# EasyEDA Pro project ProProject_PressureSensor_2023-10-08.epro, board PCB1_1
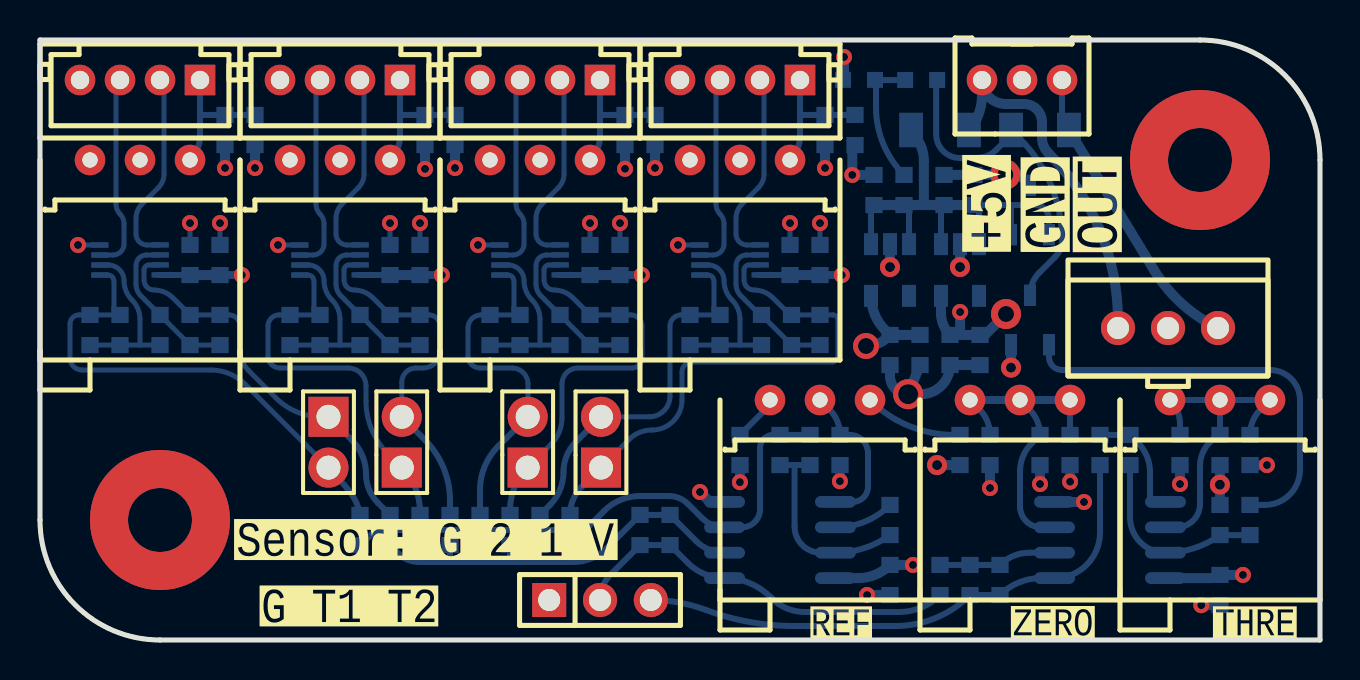
[diagram p3: board, top side]
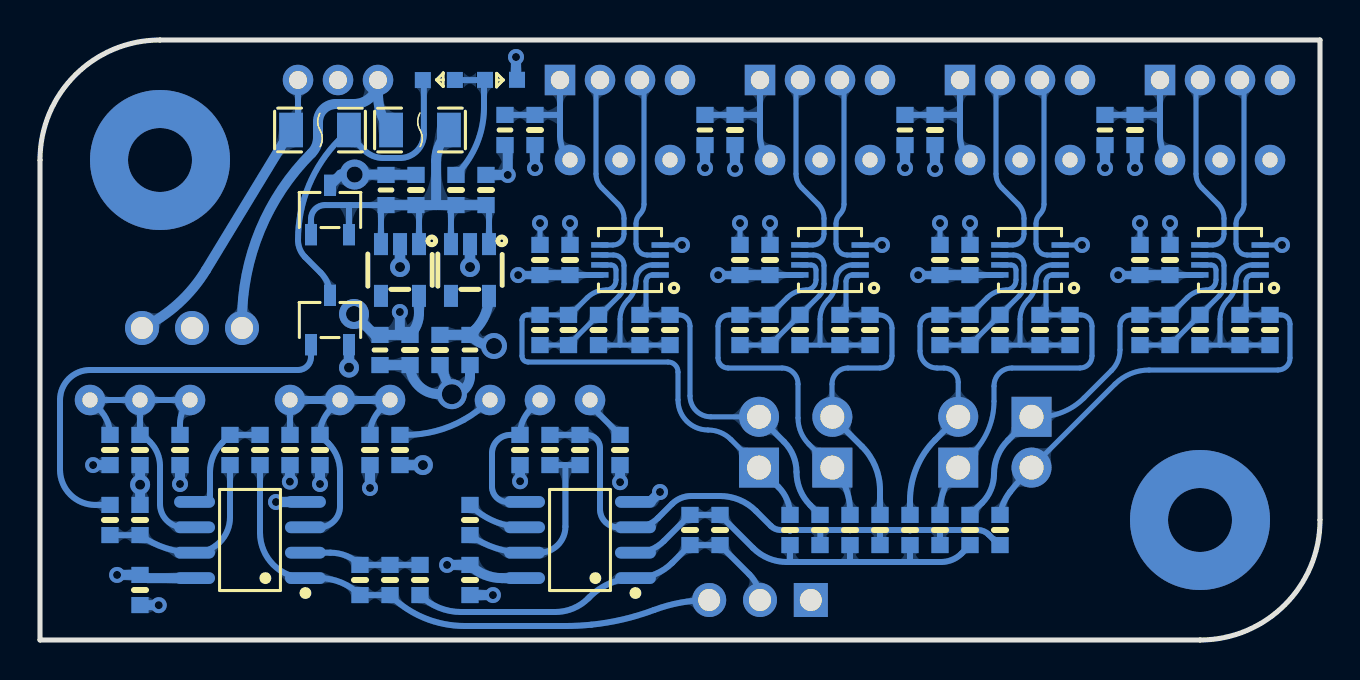
[diagram p4: board, bottom side, seen from below]

Outline 64 x 30 mm; copper layers: Top Layer, Inner1, Inner2, Bottom Layer. Coordinates in mm from the lower left corner of the outline.
Outline path: 0,6 0,30 58,30 arc(62.24,28.24) 64,24 64,0 6,0 arc(1.76,1.76) 0,6
Stack: Top Layer 0.035mm / Dielectric1 0.48mm PP er 4.5 / Inner1 0.035mm / Dielectric2 0.48mm FR4 er 4.5 / Inner2 0.035mm / Dielectric3 0.48mm PP er 4.5 / Bottom Layer 0.035mm

## Design rules (mm)
template: 自定义配置
spacing copperThickness1oz (default): track to track 0.102, other pairs 0.152 to 0.3
spacing copperThickness2oz: track to track 0.203, other pairs 0.152 to 0.3
track width copperThickness1oz (default): min 0.127, default 0.254, max 2.54
track width copperThickness2oz: min 0.203, default 0.254, max 2.54
differential pair differentialPair (default): width min 0.127, default 0.254, max 2.54; gap min 0.152, default 0.152
via viaSize (default): diameter min 0.5, default 0.61, max 10; hole min 0.3, default 0.305, max 6.3
net GND uses innerPlaneGND

## Placement (name value [footprint] x y rotation side)
C1  22uF  [R0603]  46.7 22.5 270 bottom
C2  10nF COG  [R0603]  45.2 22.5 90 bottom
C3  1uF  [R0603]  41.7 22.5 90 bottom
C4  22uF  [R0603]  42.5 14.5 90 bottom
C5  10nF COG  [R0603]  44 14.5 270 bottom
C7  22uF  [R0603]  47 14.5 90 bottom
C8  10nF COG  [R0603]  45.5 14.5 270 bottom
C9  22uF  [R0603]  10.75 25.5 90 bottom
C10  100p  [R0603]  31.5 5.5 90 bottom
C11  10nF COG  [R0603]  2.5 15.5 90 bottom
C12  100p  [R0603]  38.5 9.5 90 bottom
C13  10nF COG  [R0603]  9 15.5 270 bottom
C14  100p  [R0603]  46.5 3 90 bottom
C15  100p  [R0603]  59 6 90 bottom
C16  1uF  [R0603]  40 9.5 90 bottom
C17  1uF  [R0603]  50 9.5 90 bottom
C18  1uF  [R0603]  59 9.5 90 bottom
C19  22uF  [R0603]  20.75 25.5 90 bottom
C20  10nF COG  [R0603]  12.5 15.5 90 bottom
C21  10nF COG  [R0603]  19 15.5 270 bottom
C22  10nF COG  [R0603]  7.5 19 270 bottom
C23  10nF COG  [R0603]  17.5 19 270 bottom
C24  10nF COG  [R0603]  27.5 19 270 bottom
C25  10nF COG  [R0603]  37.5 19 270 bottom
C26  100nF  [R0603]  42.5 3 90 bottom
C27  100nF  [R0603]  59 2.5 90 bottom
C28  22uF  [R0603]  30.75 25.5 90 bottom
C29  10nF COG  [R0603]  22.5 15.5 90 bottom
C30  22uF  [R0603]  40.75 25.5 90 bottom
C31  10nF COG  [R0603]  32.5 15.5 90 bottom
C32  10nF COG  [R0603]  29 15.5 270 bottom
C33  10nF COG  [R0603]  39 15.5 270 bottom
C34  1uF  [R0603]  39 19 270 bottom
C35  1uF  [R0603]  29 19 270 bottom
C36  1uF  [R0603]  19 19 270 bottom
C37  1uF  [R0603]  9 19 270 bottom
CN1  HDGC2001WV-4P  [CONN-TH_4P-P2.00_HDGC_HDGC2001WV-4P]  5 28 180 top
CN2  HDGC2001WV-4P  [CONN-TH_4P-P2.00_HDGC_HDGC2001WV-4P]  15 28 180 top
CN3  HDGC2001WV-4P  [CONN-TH_4P-P2.00_HDGC_HDGC2001WV-4P]  25 28 180 top
CN4  HDGC2001WV-4P  [CONN-TH_4P-P2.00_HDGC_HDGC2001WV-4P]  35 28 180 top
CN5  HC-XHB-3A  [CONN-TH_3P-P2.50_HC-XHB-3A]  56.4 15.6 0 top
F1  nSMD020-30V  [F1206]  45 25.5 180 bottom
F2  nSMD020-30V  [F1206]  50 25.5 180 bottom
H2  PZ254V-11-03P  [HDR-TH_3P-P2.54-V-M]  28 2 0 top
H5  PZ254V-11-02P  [HDR-TH_2P-P2.54-V-M]  14.42 9.89 270 top
H6  PZ254V-11-02P  [HDR-TH_2P-P2.54-V-M]  24.38 9.89 90 top
H7  PZ254V-11-02P  [HDR-TH_2P-P2.54-V-M]  28.05 9.89 90 top
H8  PZ254V-11-02P  [HDR-TH_2P-P2.54-V-M]  18.09 9.89 90 top
LED3  -  [LED_0603]  41 28 0 bottom
LED4  -  [LED_0603]  44.01 28.01 180 bottom
P1  PH-3A  [CONN-TH_12P-P2.00-H-W4.8_PH-3A]  49.1 28 270 top
Q1  S8050  [SOT-23-3_L2.9-W1.6-P1.90-LS2.8-BR]  49.5 16 270 bottom
R2  2K  [R0603]  16 5.5 90 bottom
R3  15K  [R0603]  30 5.5 90 bottom
R4  2K  [R0603]  19 5.5 90 bottom
R5  50  [RES-ADJ-TH_3P-L10.0-W10.0-P2.50-L]  5 24 0 top
R6  50  [R0603]  9.25 25.5 270 bottom
R7  2K  [R0603]  22 5.5 90 bottom
R8  2K  [R0603]  4 15.5 90 bottom
R9  2K  [R0603]  25 5.5 90 bottom
R10  2K  [R0603]  17.5 5.5 90 bottom
R11  120  [R0603]  6 15.5 270 bottom
R12  2K  [R0603]  20.5 5.5 90 bottom
R13  2K  [R0603]  23.5 5.5 90 bottom
R14  2K  [R0603]  45 3 90 bottom
R15  2K  [R0603]  7.5 15.5 270 bottom
R16  2K  [R0603]  26.5 5.5 90 bottom
R17  15K  [R0603]  37 9.5 90 bottom
R18  15K  [R0603]  48 3 90 bottom
R19  2.2K  [R0603]  53 9.5 90 bottom
R20  100K  [R0603]  54.5 9.5 90 bottom
R21  2.2K  [R0603]  46 9.5 270 bottom
R22  2.2K  [R0603]  42.5 6 90 bottom
R23  15K  [R0603]  51.5 9.5 270 bottom
R24  10K  [R0603]  60.5 9.5 270 bottom
R25  10K  [RES-ADJ-TH_3P-L10.0-W10.0-P2.50-L]  39 12 0 top
R26  10K  [RES-ADJ-TH_3P-L10.0-W10.0-P2.50-L]  49 12 0 top
R27  10K  [RES-ADJ-TH_3P-L10.0-W10.0-P2.50-L]  59 12 0 top
R28  5K  [R0603]  60.5 6 270 bottom
R29  2.2K  [R0603]  35 9.5 90 bottom
R30  5K  [R0603]  47.5 9.5 90 bottom
R31  10K  [R0603]  57 9.5 90 bottom
R33  50  [RES-ADJ-TH_3P-L10.0-W10.0-P2.50-L]  15 24 0 top
R34  50  [R0603]  19.25 25.5 270 bottom
R35  2K  [R0603]  14 15.5 90 bottom
R36  120  [R0603]  16 15.5 270 bottom
R37  2K  [R0603]  17.5 15.5 270 bottom
R38  50  [RES-ADJ-TH_3P-L10.0-W10.0-P2.50-L]  25 24 0 top
R39  50  [R0603]  29.25 25.5 270 bottom
R40  50  [RES-ADJ-TH_3P-L10.0-W10.0-P2.50-L]  35 24 0 top
R41  2K  [R0603]  24 15.5 90 bottom
R42  50  [R0603]  39.25 25.5 270 bottom
R43  2K  [R0603]  34 15.5 90 bottom
R44  120  [R0603]  26 15.5 270 bottom
R45  120  [R0603]  36.07 15.5 270 bottom
R46  2K  [R0603]  27.5 15.5 270 bottom
R47  2K  [R0603]  37.57 15.5 270 bottom
R48  10K  [R0603]  43.2 22.5 270 bottom
TV1  ESDA5V3L  [SOT-23-3_L2.9-W1.6-P1.90-LS2.8-BR]  49.5 21.5 270 bottom
U1  LP5907MFX-4.5/NOPB  [TSOT-23-5_L2.9-W1.6-P0.95-LS2.8-BR]  42.5 18.5 90 bottom
U2  LP5907MFX-4.5/NOPB  [TSOT-23-5_L2.9-W1.6-P0.95-LS2.8-BR]  46 18.5 90 bottom
U4  TLV2333IDGKR  [SOIC-8_L4.9-W3.9-P1.27-LS6.0-BL]  37 5 90 bottom
U5  TLV2333IDGKR  [SOIC-8_L4.9-W3.9-P1.27-LS6.0-BL]  53.5 5 90 bottom
U9  OPA1612AIDRGR  [SON-8_L3.0-W3.0-P0.50-TL-EP_OPA1612AIDRGR]  4.5 19 0 bottom
U10  OPA1612AIDRGR  [SON-8_L3.0-W3.0-P0.50-TL-EP_OPA1612AIDRGR]  14.5 19 0 bottom
U11  OPA1612AIDRGR  [SON-8_L3.0-W3.0-P0.50-TL-EP_OPA1612AIDRGR]  24.5 19 0 bottom
U12  OPA1612AIDRGR  [SON-8_L3.0-W3.0-P0.50-TL-EP_OPA1612AIDRGR]  34.5 19 0 bottom

## Footprints (pads in the part's own frame, mm; a bottom-side part is the same pattern mirrored in y, then rotated)
CONN-TH_3P-P2.50_HC-XHB-3A
  round 1.7 hole 1.1: 1(-2.5,0) 2(0,0) 3(2.5,0)
CONN-TH_4P-P2.00_HDGC_HDGC2001WV-4P
  rect 1.524x1.524 hole 0.914: 1(-3,0)
  round 1.524 hole 0.914: 2(-1,0) 3(1,0) 4(3,0)
CONN-TH_12P-P2.00-H-W4.8_PH-3A
  round 1.524 hole 0.9: 1(0,2) 2(0,0) 3(0,-2)
F1206
  rect 1.19x1.728 smd: 1(-1.445,0) 2(1.445,0)
HDR-TH_2P-P2.54-V-M
  rect 2x2 hole 1.2: 1(-1.27,0)
  round 2 hole 1.2: 2(1.27,0)
HDR-TH_3P-P2.54-V-M
  rect 1.7x1.7 hole 1.1: 1(-2.54,0)
  round 1.7 hole 1.1: 2(0,0) 3(2.54,0)
LED_0603
  rect 0.8x0.8 smd: 1(-0.851,-0.01) 2(0.75,-0.005)
R0603
  rect 0.806x0.864 smd: 1(-0.753,0) 2(0.753,0)
RES-ADJ-TH_3P-L10.0-W10.0-P2.50-L
  round 1.524 hole 0.762: 1(-2.5,0) 2(0,0) 3(2.5,0)
SOIC-8_L4.9-W3.9-P1.27-LS6.0-BL
  oval 0.588x2.045 smd: 1(-1.905,-2.772) 2(-0.635,-2.772) 3(0.635,-2.772) 4(1.905,-2.772) 5(1.905,2.772) 6(0.635,2.772) 7(-0.635,2.772) 8(-1.905,2.772)
SON-8_L3.0-W3.0-P0.50-TL-EP_OPA1612AIDRGR
  rect 0.865x0.28 smd: 1(-1.508,0.75) 2(-1.508,0.25) 3(-1.508,-0.25) 4(-1.508,-0.75) 5(1.508,-0.755) 6(1.508,-0.255) 7(1.508,0.245) 8(1.508,0.745)
SOT-23-3_L2.9-W1.6-P1.90-LS2.8-BR
  rect 1.07x0.6 smd: 1(1.235,-0.95) 2(1.235,0.95) 3(-1.235,0)
TSOT-23-5_L2.9-W1.6-P0.95-LS2.8-BR
  rect 1.1x0.7 smd: 1(1.294,-0.951) 2(1.294,-0.001) 3(1.294,0.951) 4(-1.294,0.951) 5(-1.294,-0.949)

## Nets
As in the schematic.

Pads without a net: U1 4; U2 4

## Via types
v1: diameter 7, hole 3.2, Top Layer to Bottom Layer, 2 vias
v2: diameter 0.8, hole 0.4, Top Layer to Bottom Layer, 39 vias
v3: diameter 1.5, hole 1, Top Layer to Bottom Layer, 1 via
v4: diameter 1, hole 0.5, Top Layer to Bottom Layer, 5 vias
v5: diameter 1.5, hole 0.8, Top Layer to Bottom Layer, 2 vias
v6: diameter 1.3, hole 0.8, Top Layer to Bottom Layer, 1 via

## Routing (per net, layer and track width the routed paths; a pad name or vN(x,y) marks a point on that pad's centre or on a via; arc(x,y) is an arc through that point)
GND: length 47.8
  Bottom Layer w0.25: C36.1 v2(19,20.85) ; U12.4 v2(31.9,19.75) ; C35.1 v2(29,20.85) ; C22.1 v2(7.5,20.85) ; C23.1 v2(17.5,20.85) ; U11.4 v2(21.9,19.75) ; C25.1 v2(37.5,20.85) ; C37.1 v2(9,20.85) ; U10.4 v2(11.9,19.75) ; C34.1 v2(39,20.85) ; C24.1 v2(27.5,20.85) ; U9.4 v2(1.9,19.75)
  Bottom Layer w0.5: C18.1 59,8.74 v4(59,7.76) 59,6.76 C15.2 ; U4.4 34.22,6.9 33.5,6.9 v2(33,7.4) ; TV1.3 48.96,23.27 v5(48.27,23.27) C2.2 ; v2(40,7.94) 40,8.7 40,8.7 ; C4.1 42.5,13.2 arc(42.77,12.56) v3(43.41,12.29) ; U1.2 v4(42.5,18.65) ; C26.1 v2(41.35,2.25) ; C3.2 v2(40.61,23.25) 40.61,24.61 C30.1 ; v2(57,7.8) R31.1 ; 58.95,1.7 58.91,1.74 v2(58.06,1.74) ; C5.2 v3(43.41,12.29) ; v3(43.41,12.29) 44.04,12.29 arc(45.07,12.72) C8.2 C7.1 ; C9.1 v2(10.75,23.6) ; 40.2,28 v2(40.2,29.15) ; U5.4 50.73,6.9 v2(52.2,6.9) ; C19.1 v2(20.75,23.6) ; U2.2 v4(46,18.65) ; v2(50,7.8) C17.1 ; Q1.2 v4(48.55,13.62) ; v2(35,7.89) 35,8.65 ; C28.1 v2(30.75,23.6) ; v2(47.5,7.6) R30.1
VCC: length 29.8
  Bottom Layer w0.3: C23.2 17.5,18.25 15.91,18.25 ; C25.2 37.5,18.25 35.91,18.25 ; 25.91,18.25 27.5,18.25 C24.2 ; 5.91,18.25 7.5,18.25
  Bottom Layer w0.4: C34.2 v2(40.09,18.25) ; C37.2 v2(10.09,18.25) ; C36.2 v2(20.09,18.25) ; C35.2 v2(30.09,18.25)
  Bottom Layer w0.5: C24.2 C35.2 ; C25.2 C34.2 ; v2(60.15,3.25) C27.2 arc(58.82,3.14) 58.62,3.09 U5.8 ; C4.2 C5.1 ; C4.2 42.47,15.23 arc(41.94,14.84) v6(41.3,14.7) ; C4.2 42.26,15.49 arc(41.74,16.28) U1.5 ; U4.8 40.91,3.09 arc(41.77,3.27) C26.2 v2(43.65,3.75) ; C36.2 17.5,18.25 arc(17.5,18.25) 17.5,18.25 ; C22.2 C37.2
VCCREF: length 13.8
  Bottom Layer w0.5: 51.5,8.7 51.51,8.69 v2(51.51,7.92) ; 29.25,24.7 v2(29.25,23.56) ; R42.2 v2(39.25,23.6) ; R6.2 v2(9.25,23.6) ; 19.25,24.7 v2(19.25,23.55) ; 46.01,15.25 v2(46.01,16.4) ; v2(61.35,8.75) R24.2 ; R21.2 v4(44.85,8.75) ; U2.5 45.05,16.34 arc(45.17,15.75) C8.1 C7.2 47.25,15.25 v5(48.3,16.3)
(no net):
  vias: v1(6,6) v1(58,24)
N1: length 25.2
  Bottom Layer w0.25: 3.09,18.25 3.38,18.25 arc(3.61,18.16) 3.7,17.93 3.7,16.55 arc(3.79,16.34) R8.2 C11.2 1.95,16.25 arc(1.63,16.12) 1.5,15.8 1.5,14.1 arc(1.68,13.68) 2.1,13.5 8.54,13.5 arc(9.47,13.32) 10.25,12.79 H5.2
  Bottom Layer w0.3: R2.2 arc(15.82,6.86) 15.5,7.4 arc(14.98,8.03) H5.2
N2: length 20.1
  Bottom Layer w0.25: H8.1 17.39,9.32 arc(16.58,10.52) 16.3,11.94 16.3,12.7 arc(16.04,13.34) 15.4,13.6 12,13.6 arc(11.58,13.78) 11.4,14.2 11.4,15.7 arc(11.56,16.09) 11.95,16.25 C20.2 R35.2 arc(13.79,16.34) 13.7,16.55 13.7,17.93 arc(13.61,18.16) 13.38,18.25 13.09,18.25
  Bottom Layer w0.3: R4.2 19,6.42 arc(18.76,7.61) H8.1
N3: length 18.2
  Bottom Layer w0.25: 23.09,18.25 23.38,18.25 arc(23.61,18.16) 23.7,17.93 23.7,16.55 arc(23.79,16.34) R41.2 C29.2 22.05,16.25 arc(21.59,16.06) 21.4,15.6 21.4,14.2 arc(21.58,13.78) 22,13.6 23.6,13.6 arc(24.17,13.37) 24.4,12.8 24.4,11.18 arc(24.4,11.16) H6.2
  Bottom Layer w0.3: R7.2 22,7.5 arc(22.23,8.68) 22.9,9.68 H6.2
N4: length 19
  Bottom Layer w0.25: 33.09,18.25 33.38,18.25 arc(33.61,18.16) 33.7,17.93 33.7,16.55 arc(33.79,16.34) R43.2 C31.2 32.05,16.25 arc(31.66,16.09) 31.5,15.7 31.5,12.2 arc(31.2,11.46) 30.46,11.16 H7.2
  Bottom Layer w0.3: R9.2 25.49,6.74 arc(26,7.5) 26.18,8.4 arc(26.34,9.22) 26.8,9.92 H7.2
OUTPUT: length 17.2
  Bottom Layer w0.3: F2.2 49.01,25.04 arc(50.56,22.73) 51.1,20 arc(51.01,19.54) 50.75,19.15 49.97,18.37 arc(49.62,17.85) Q1.3 ; 44.81,28 44.81,25.29 arc(45.16,24.45) 46,24.1 46.83,24.1 arc(47.36,24.2) 47.8,24.5 48.38,25.08 arc(48.51,25.22) 48.56,25.4
P1: length 20.4
  Bottom Layer w0.25: H5.1 14.07,11.16 arc(12.84,11.4) 11.8,12.1 10.42,13.48 arc(10.11,13.95) 10,14.5 10,15.7 arc(9.84,16.09) 9.45,16.25 C13.1 R15.1 6.64,17.11 arc(6.21,17.4) 5.7,17.5 arc(5.35,17.65) 5.2,18 5.2,18.5 arc(5.27,18.68) 5.45,18.75 5.91,18.75
  Bottom Layer w0.3: R10.2 16.9,6.85 arc(16.46,7.52) 16.3,8.3 arc(16.12,9.21) 15.6,9.98 H5.1
P2: length 18.7
  Bottom Layer w0.25: 15.91,18.75 15.45,18.75 arc(15.27,18.68) 15.2,18.5 15.2,18 arc(15.35,17.65) 15.7,17.5 arc(16.21,17.4) 16.64,17.11 R37.1 C21.1 19.45,16.25 arc(19.84,16.09) 20,15.7 20,14.45 arc(19.75,13.85) 19.15,13.6 18.8,13.6 arc(18.3,13.39) 18.09,12.89 H8.2
  Bottom Layer w0.3: R12.2 20.5,6.97 arc(20.17,8.61) 19.25,10 H8.2
P3: length 21.1
  Bottom Layer w0.25: 25.91,18.75 25.45,18.75 arc(25.27,18.68) 25.2,18.5 25.2,18 arc(25.35,17.65) 25.7,17.5 arc(26.21,17.4) 26.64,17.11 R46.1 C32.1 29.55,16.25 arc(29.94,16.09) 30.1,15.7 30.1,14.1 arc(29.95,13.75) 29.6,13.6 26.9,13.6 arc(26.33,13.37) 26.1,12.8 26.1,11.1 arc(25.96,10.39) 25.56,9.8 H6.1
  Bottom Layer w0.3: R13.2 23.5,6.49 arc(23.73,7.64) H6.1
P4: length 27.4
  Bottom Layer w0.25: 35.91,18.75 35.45,18.75 arc(35.27,18.68) 35.2,18.5 35.2,18 arc(35.35,17.65) 35.7,17.5 arc(36.21,17.4) 36.64,17.11 37.5,16.25 ; R47.1 C33.1 39.65,16.25 arc(39.83,16.18) 39.9,16 39.9,14.2 arc(39.81,13.99) 39.6,13.9 32.6,13.9 arc(32.25,13.75) 32.1,13.4 32.1,12 arc(31.66,10.94) 30.6,10.5 arc(29.98,10.38) 29.45,10.03 H7.1
  Bottom Layer w0.3: R16.2 arc(26.65,7.01) 27.08,7.65 H7.1 arc(28.3,8.67) 28.51,8.81
$1N30553: length 9.8
  Bottom Layer w0.25: 3.09,19.25 3.65,19.25 arc(4.04,19.41) 4.2,19.8 4.2,20.82 arc(4.15,21.08) 4,21.3 arc(3.85,21.52) 3.8,21.78 3.8,27.52 arc(3.85,27.78) CN1.3
$1N30561: length 9.7
  Bottom Layer w0.25: 5.91,19.75 5.35,19.75 arc(4.96,19.91) 4.8,20.3 4.8,21.08 arc(4.88,21.47) 5.1,21.8 5.92,22.62 arc(6.13,22.93) 6.2,23.3 6.2,27.52 arc(6.15,27.78) CN1.2
$1N30605: length 8.5
  Bottom Layer w0.25: C11.1 R8.1 5,14.75 ; 3.09,18.75 3.42,18.75 arc(3.97,18.52) 4.2,17.97 arc(4.3,17.44) 4.6,17 arc(4.9,16.56) 5,16.04 5,14.75 ; 5,14.75 R11.2
$1N30608: length 8
  Bottom Layer w0.25: C13.2 R15.2 R11.1 5.05,17.21 arc(4.86,17.48) 4.8,17.8 4.8,18.72 arc(4.95,19.1) 5.33,19.25 5.91,19.25
$1N32010: length 5
  Bottom Layer w0.3: R21.1 45.72,10.25 arc(44.21,10.45) 42.81,11.01 arc(42.12,11.46) R25.3
$1N32012: length 2.3
  Bottom Layer w0.3: R29.2 36.33,11.58 arc(36.45,11.77) R25.1
$1N32045: length 7.7
  Bottom Layer w0.3: U4.5 40.64,6.91 arc(41.18,7.13) 41.4,7.66 41.4,9.34 arc(41.13,9.99) 40.48,10.25 C16.2 arc(39.86,10.94) 39.47,11.53 R25.2
$1N32103: length 3
  Bottom Layer w0.3: R22.2 arc(41.25,5.92) U4.6
$1N32162: length 21.1
  Bottom Layer w0.3: 31.5,6.25 32.8,4.95 arc(33.45,4.52) 34.22,4.36 U4.2 ; R13.1 23.5,3.92 arc(23.5,3.91) 23.51,3.9 ; R10.1 17.92,4.32 arc(18.39,4.01) 18.95,3.9 20.5,3.9 ; R16.1 26.5,3.98 arc(26.49,3.94) 26.47,3.9 ; 23.51,3.9 26.47,3.9 ; 23.51,3.9 20.5,3.9 ; 26.47,3.9 26.66,3.9 arc(27.57,4.08) 28.34,4.6 R3.2 C10.2 ; R12.1 20.5,3.91 arc(20.5,3.9) 20.5,3.9
$1N32193: length 10.3
  Bottom Layer w0.3: 37.73,8.75 C12.1 ; 37.73,8.75 37.73,5.67 arc(38.11,4.75) 39.03,4.36 U4.7 arc(41.21,4.59) R22.1 ; 37.73,8.75 R17.1
$1N32196: length 29.8
  Bottom Layer w0.3: R7.1 22,5.47 arc(22,5.48) 22.01,5.5 ; 19,5.5 22.01,5.5 ; 19,5.5 17.11,5.5 arc(16.82,5.44) 16.57,5.28 16.31,5.01 16.28,5.03 ; 19,5.5 arc(19,5.5) 19,5.5 R4.1 ; 22.01,5.5 24.99,5.5 ; 24.99,5.5 26.97,5.5 arc(27.23,5.55) 27.45,5.7 28.21,6.46 arc(29.03,7.01) 30,7.2 31.43,7.2 arc(31.96,7.1) 32.4,6.8 33.1,6.1 arc(33.62,5.76) U4.3 35.1,5.64 arc(35.74,5.9) 36,6.54 36,9.59 arc(36.19,10.06) 36.66,10.25 R17.2 C12.2 ; 24.99,5.5 24.99,4.78 arc(24.99,4.76) R9.1 ; 23.5,5.48 arc(23.5,5.49) 23.51,5.5 ; 20.5,5.47 arc(20.5,5.49) 20.51,5.5 ; 26.5,5.45 arc(26.5,5.48) 26.52,5.5
$1N33007: length 5.9
  Bottom Layer w0.3: R19.2 R20.2 54.9,9.86 arc(55.34,9.19) 55.5,8.4 55.5,6.91 U5.5
$1N33240: length 21.4
  Bottom Layer w0.3: Q1.1 50.45,14.15 arc(50.64,13.69) 51.1,13.5 61.5,13.5 arc(62.56,13.06) 63,12 63,8.52 arc(62.48,7.27) 61.24,6.75 R28.1
$1N33276: length 9.8
  Bottom Layer w0.3: R20.1 54.5,6.14 arc(55.02,4.88) U5.7 arc(57.71,4.59) C15.1 arc(59.75,5.25) 60.5,5.24
$1N35532: length 19.8
  Bottom Layer w0.3: 31.5,4.75 32.39,3.86 arc(33.23,3.29) U4.1 arc(35.47,2.85) 36.53,2.14 36.59,2.08 arc(37.34,1.58) 38.23,1.4 42.96,1.4 arc(44.06,1.62) R14.1 ; C10.1 R3.1 28.53,3.27 arc(28.14,2.69) H2.2
$1N36334: length 27.9
  Bottom Layer w0.3: R19.1 53,5.37 arc(52.33,3.76) U5.1 50.05,3.09 arc(48.94,2.87) R18.1 C14.1 arc(44.79,1.1) 42.77,0.7 37.68,0.7 arc(37.06,0.72) 36.44,0.77 arc(34.84,1.03) 33.3,1.5 arc(31.94,1.87) H2.3
$1N36352: length 5.9
  Bottom Layer w0.3: R14.2 C14.2 R18.2 arc(48.68,4.21) 49.48,4.36 U5.2
$1N36780: length 9.8
  Bottom Layer w0.25: 13.09,19.25 13.65,19.25 arc(14.04,19.41) 14.2,19.8 14.2,20.82 arc(14.15,21.08) 14,21.3 arc(13.85,21.52) 13.8,21.78 13.8,27.52 arc(13.85,27.78) CN2.3
$1N36784: length 9.7
  Bottom Layer w0.25: 15.91,19.75 15.35,19.75 arc(14.96,19.91) 14.8,20.3 14.8,21.08 arc(14.88,21.47) 15.1,21.8 15.92,22.62 arc(16.13,22.93) 16.2,23.3 16.2,27.52 arc(16.15,27.78) CN2.2
$1N36792: length 8.5
  Bottom Layer w0.25: R36.2 R35.1 C20.1 ; 15,14.75 15,16.04 arc(14.9,16.56) 14.6,17 arc(14.3,17.44) 14.2,17.97 arc(13.97,18.52) 13.42,18.75 13.09,18.75
$1N36797: length 8
  Bottom Layer w0.25: C21.2 R37.2 arc(17.5,14.75) 17.5,14.76 R36.1 15.04,17.21 arc(14.86,17.48) 14.8,17.8 14.8,18.72 arc(14.95,19.1) 15.32,19.25 15.91,19.25
$1N37205: length 9.8
  Bottom Layer w0.25: 23.09,19.25 23.65,19.25 arc(24.04,19.41) 24.2,19.8 24.2,20.82 arc(24.15,21.08) 24,21.3 arc(23.85,21.52) 23.8,21.78 23.8,27.52 arc(23.85,27.78) CN3.3
$1N37209: length 9.7
  Bottom Layer w0.25: 25.91,19.75 25.35,19.75 arc(24.96,19.91) 24.8,20.3 24.8,21.08 arc(24.88,21.47) 25.1,21.8 25.92,22.62 arc(26.13,22.93) 26.2,23.3 26.2,27.52 arc(26.15,27.78) CN3.2
$1N37217: length 8.5
  Bottom Layer w0.25: 25,14.75 25,16.04 arc(24.9,16.56) 24.6,17 arc(24.3,17.44) 24.2,17.97 arc(23.97,18.52) 23.42,18.75 23.09,18.75 ; R44.2 R41.1 C29.1
$1N37222: length 8
  Bottom Layer w0.25: 25.91,19.25 25.32,19.25 arc(24.95,19.1) 24.8,18.72 24.8,17.8 arc(24.86,17.48) 25.04,17.21 R44.1 27.5,14.76 arc(27.5,14.75) R46.2 C32.2
$1N37630: length 9.8
  Bottom Layer w0.25: 33.09,19.25 33.65,19.25 arc(34.04,19.41) 34.2,19.8 34.2,20.82 arc(34.15,21.08) 34,21.3 arc(33.85,21.52) 33.8,21.78 33.8,27.52 arc(33.85,27.78) CN4.3
$1N37634: length 9.7
  Bottom Layer w0.25: 35.91,19.75 35.35,19.75 arc(34.96,19.91) 34.8,20.3 34.8,21.08 arc(34.88,21.47) 35.1,21.8 35.92,22.62 arc(36.13,22.93) 36.2,23.3 36.2,27.52 arc(36.15,27.78) CN4.2
$1N37642: length 8.6
  Bottom Layer w0.25: 35,14.75 35,16.04 arc(34.9,16.56) 34.6,17 arc(34.3,17.44) 34.2,17.97 arc(33.97,18.52) 33.42,18.75 33.09,18.75 ; C31.1 R43.1 R45.2
$1N37647: length 7.9
  Bottom Layer w0.25: R45.1 37.57,14.76 arc(37.57,14.75) R47.2 C33.2 ; 36,16.25 35.04,17.21 arc(34.86,17.48) 34.8,17.8 34.8,18.72 arc(34.95,19.1) 35.32,19.25 35.91,19.25
$1N37723: length 6.8
  Bottom Layer w0.3: 18.06,26.25 R34.1 C19.2 ; CN2.1 18,25.21 arc(17.87,24.55) R33.3
$1N37747: length 6.8
  Bottom Layer w0.3: CN3.1 28,25.21 arc(27.87,24.55) R38.3 ; C28.2 R39.1 28.06,26.25
$1N37752: length 6.9
  Bottom Layer w0.3: CN1.1 8,26.23 ; 8,26.23 8,25.21 arc(7.87,24.55) R5.3 ; 8,26.23 arc(8.03,26.25) 8.06,26.25 R6.1 C9.2
$1N37762: length 6.8
  Bottom Layer w0.3: CN4.1 38,25.21 arc(37.87,24.55) R40.3 ; 38.06,26.25 R42.1 C30.2
$1N42503: length 19
  Bottom Layer w0.5: 53.9,15 CN5.1 53.9,15.95 arc(53,20.49) 50.43,24.34 arc(50.18,24.7) 50.1,25.13 50.1,25.9 arc(49.84,26.54) 49.2,26.8 48.3,26.8 arc(47.45,27.15) P1.3 47.1,27.23 arc(46.89,26.19) 46.3,25.3
$1N42542: length 15.8
  Bottom Layer w0.3: P1.1 51.1,26.33 arc(51.19,25.84) 51.44,25.4
  Bottom Layer w0.5: F2.1 55.7,18.5 arc(57.09,16.82) CN5.3 ; 51.44,25.4 arc(51.51,25.13) 51.69,24.91
$1N42787: length 6.5
  Bottom Layer w0.3: R48.1 arc(42.16,24.8) 41.8,26.63 41.8,28 43.18,28 arc(43.19,28) 43.21,28.01
$1N42798: length 23.3
  Bottom Layer w0.3: U1.3 43.45,21.59 arc(43.47,21.67) 43.52,21.75 ; 46.95,21.75 48.51,21.75 ; 46.95,21.75 C1.2 ; 46.95,21.75 arc(46.95,21.74) 46.95,21.74 U2.3 ; 48.51,21.75 49.76,21.75 arc(50.25,21.54) 50.45,21.05 TV1.1 ; 48.51,21.75 arc(48.54,21.74) 48.55,21.71 TV1.2 ; U2.1 45.05,21.63 arc(45.14,21.67) C2.1 ; U1.1 41.55,21.63 arc(41.64,21.67) C3.1
  Bottom Layer w0.5: 44.19,21.75 C2.1 C1.2 ; 44.19,21.75 C3.1 ; 44.19,21.75 44.19,23.96 arc(44.03,24.75) 43.56,25.4
$1N53934: length 17.1
  Bottom Layer w0.3: R26.2 49.47,11.53 arc(49.86,10.94) C17.2 49.59,9.84 arc(49.15,9.19) 49,8.42 49,6.69 arc(49.31,5.94) 50.05,5.64 U5.3 ; R26.1 46.97,11.53 arc(47.36,10.94) R30.2 ; R26.3 R23.1
  Bottom Layer w0.4: R26.1 R26.2 R26.3
$1N61093: length 17
  Bottom Layer w0.3: R31.2 57,10.79 arc(56.87,11.45) R27.1 R27.2 ; R27.2 R27.3 61.03,11.53 arc(60.64,10.94) R24.1 ; R27.2 C18.2 arc(58.86,10.23) 58.75,10.15 58.5,9.9 arc(58.13,9.35) 58,8.69 58,6.8 arc(57.66,5.98) 56.84,5.64 U5.6

## Copper pours and planes (outline as drawn; the poured copper is in the pictures)
GND on Top Layer: 0,30 64,30 64,0 0,0
GND on Inner2: 56,16 56.8,16 56.8,14.09 56,14.09
GND on Inner2: 56,17.11 56.8,17.11 56.8,15.2 56,15.2
GND on Inner2: 1.6,29.42 2.4,29.42 2.4,27.6 1.6,27.6
GND on Inner2: 48.7,28.4 49.5,28.4 49.5,26.58 48.7,26.58
GND on Inner2: 21.6,29.42 22.4,29.42 22.4,27.6 21.6,27.6
GND on Inner2: 0.26,29.74 63.74,29.74 63.74,0.26 0.26,0.26
GND on Inner2: 10.58,28.4 12.4,28.4 12.4,27.6 10.58,27.6
GND on Inner2: 30.58,28.4 32.4,28.4 32.4,27.6 30.58,27.6
GND on Inner2: 31.6,28.4 32.4,28.4 32.4,26.58 31.6,26.58
GND on Inner2: 20.58,28.4 22.4,28.4 22.4,27.6 20.58,27.6
GND on Inner2: 0.58,28.4 2.4,28.4 2.4,27.6 0.58,27.6
GND on Inner2: 25.06,2.4 25.86,2.4 25.86,0.49 25.06,0.49
GND on Inner2: 11.6,28.4 12.4,28.4 12.4,26.58 11.6,26.58
GND on Inner2: 31.6,29.42 32.4,29.42 32.4,27.6 31.6,27.6
GND on Inner2: 1.6,28.4 2.4,28.4 2.4,26.58 1.6,26.58
GND on Inner2: 25.06,3.51 25.86,3.51 25.86,1.6 25.06,1.6
GND on Inner2: 11.6,29.42 12.4,29.42 12.4,27.6 11.6,27.6
GND on Inner2: 21.6,28.4 22.4,28.4 22.4,26.58 21.6,26.58
GND on Inner2: 23.95,2.4 25.86,2.4 25.86,1.6 23.95,1.6
GND on Inner2: 48.7,29.42 49.5,29.42 49.5,27.6 48.7,27.6
VCC on Inner1: 0.5,21.66 63.5,21.66 63.5,0.5 0.5,0.5
VCCREF on Inner1: 0.5,29.5 63.5,29.5 63.5,6.66 0.5,6.66

Small or netless copper shapes (teardrops, artwork), in the pictures only: 406 on Bottom Layer, 32 on Inner1

## Text on the board
Top Silkscreen Layer: REF | ZERO | THRE | G T1 T2 | Sensor: G 2 1 V | +5V | GND | OUT
